# Altium schematic sheet Ethernet.SchDoc
size 420 x 297 mm; Address1: Address1; Address2: Address2; Address3: Address3; Address4: Address4; DocumentNumber: *Э3; SheetNumber: 13; SheetTotal: 15; DocumentType: Схема электрическая *
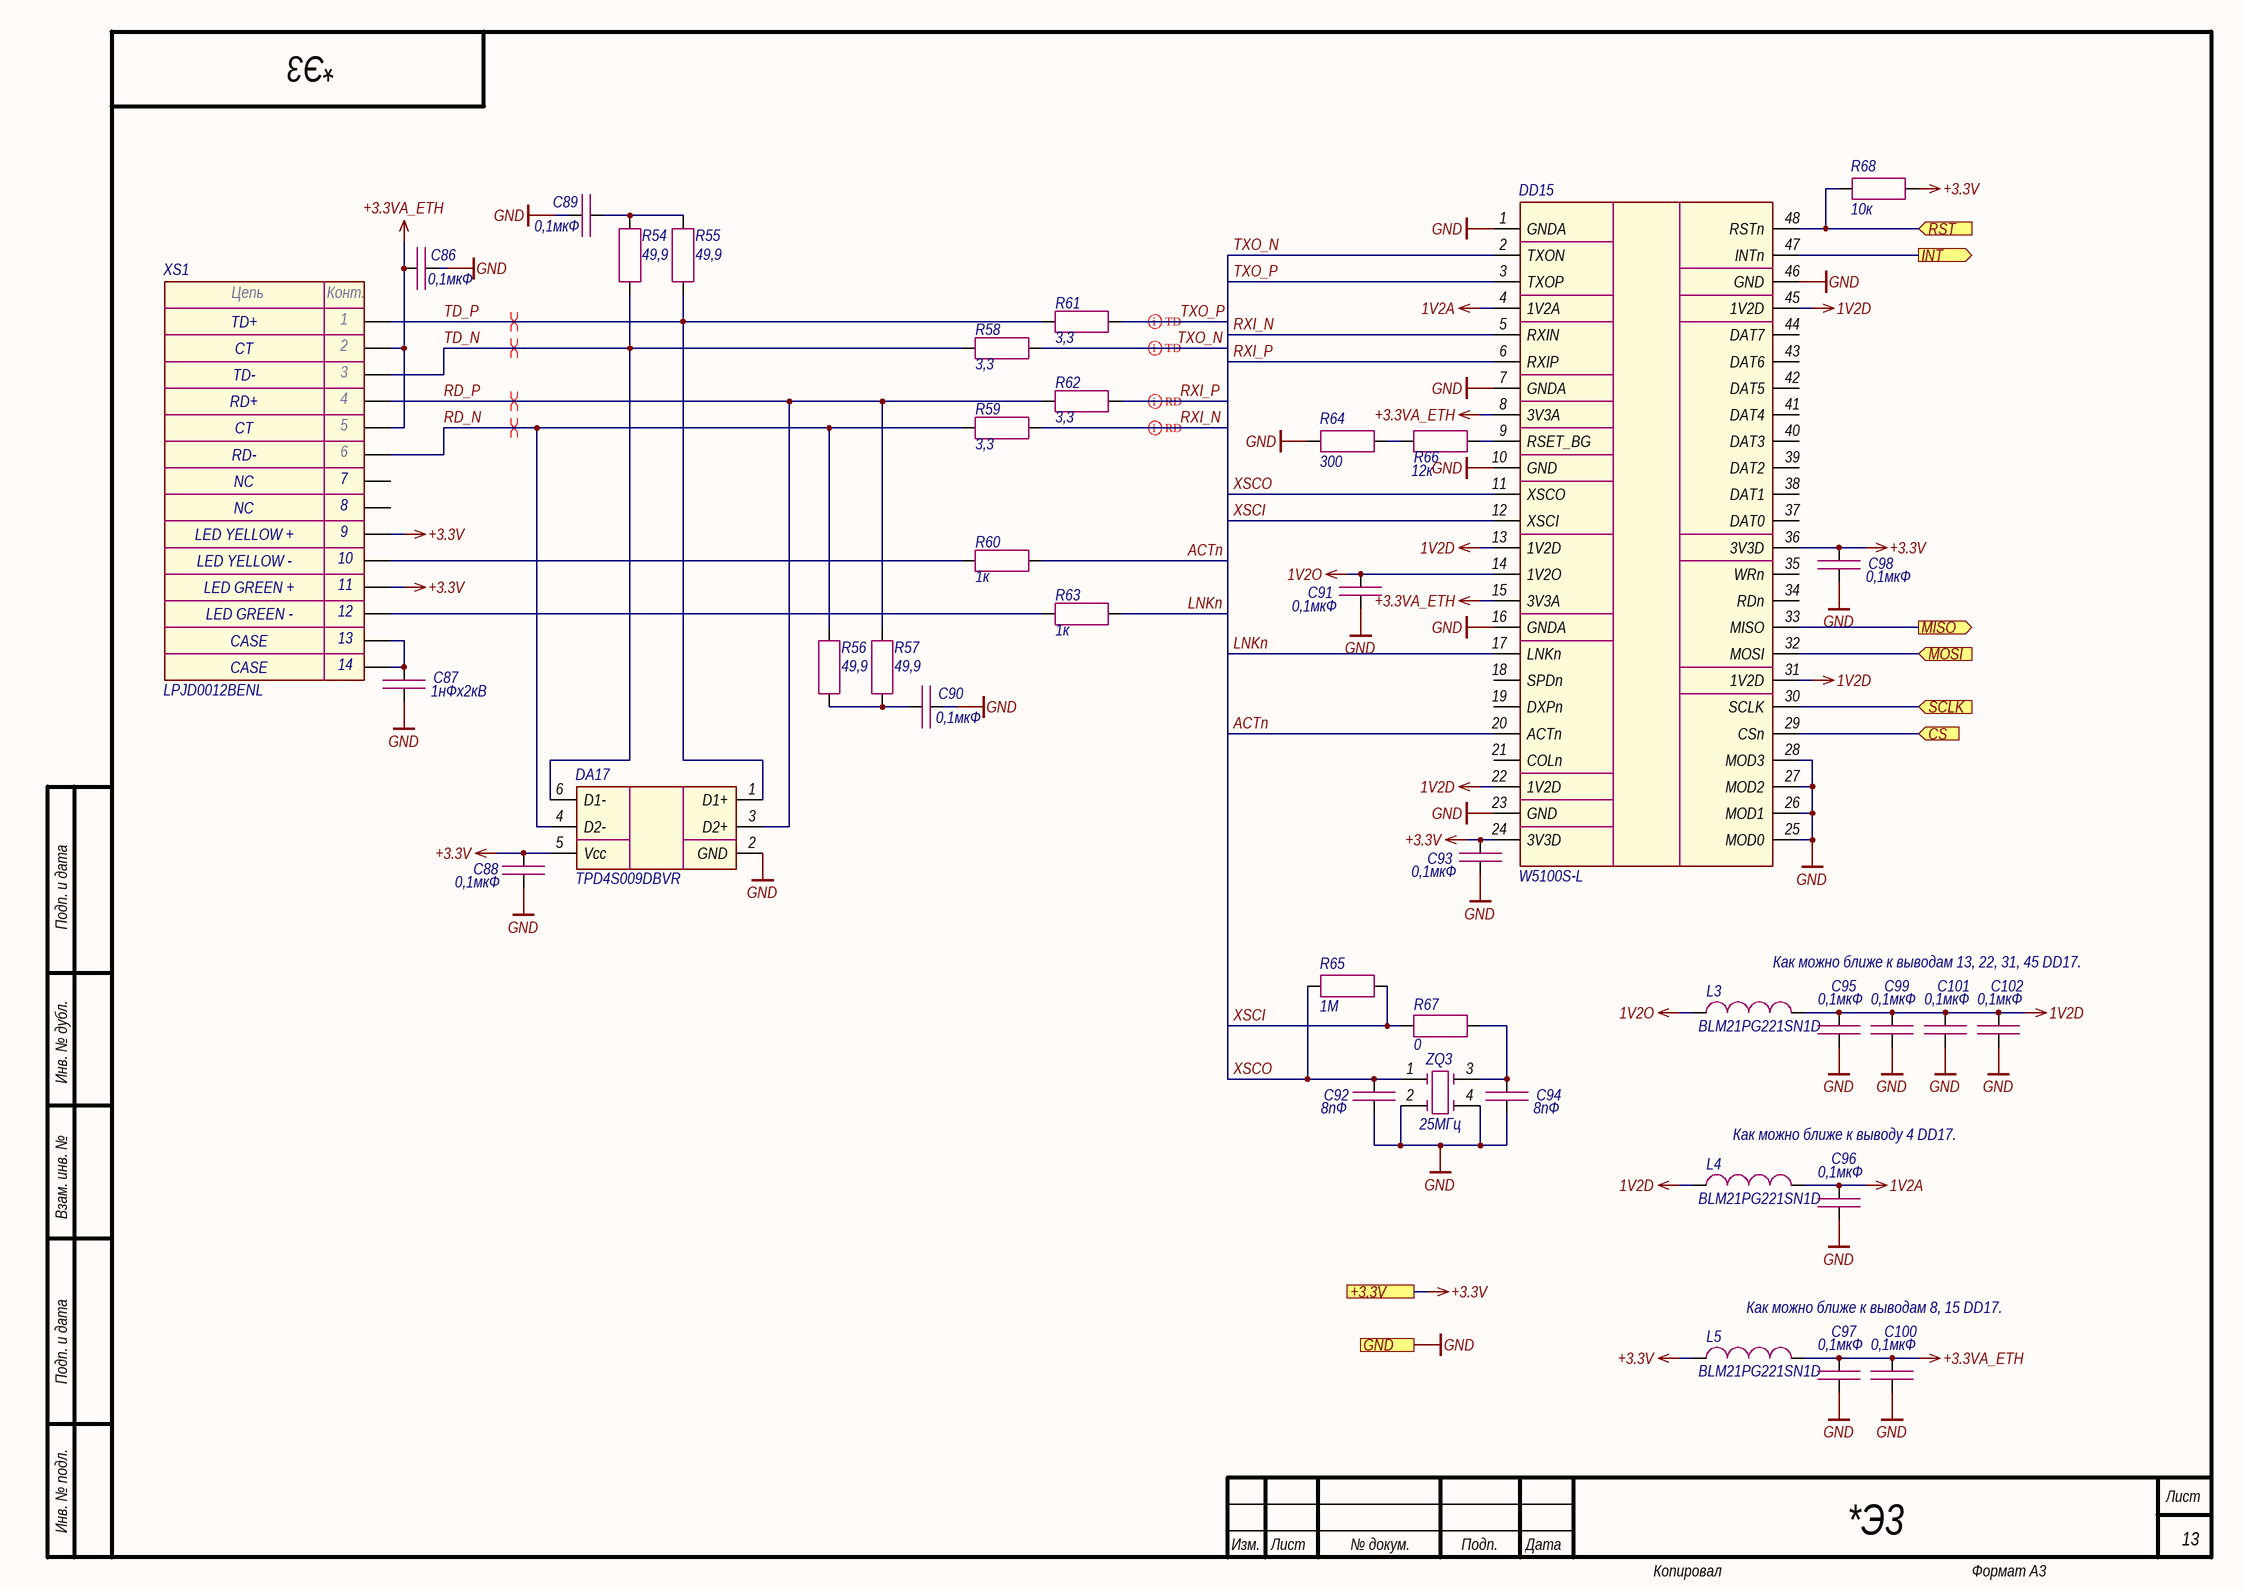
[diagram p0: Ethernet.SchDoc]

## Parts
C86  0,1мкФ  [CAP_0603]
C87  1нФх2кВ  [CAP_1206]
C88  0,1мкФ  [CAP_0603]
C89  0,1мкФ  [CAP_0603]
C90  0,1мкФ  [CAP_0603]
C91  0,1мкФ  [CAP_0603]
C92  8пФ  [CAP_0603]
C93  0,1мкФ  [CAP_0603]
C94  8пФ  [CAP_0603]
C95  0,1мкФ  [CAP_0603]
C96  0,1мкФ  [CAP_0603]
C97  0,1мкФ  [CAP_0603]
C98  0,1мкФ  [CAP_0603]
C99  0,1мкФ  [CAP_0603]
C100  0,1мкФ  [CAP_0603]
C101  0,1мкФ  [CAP_0603]
C102  0,1мкФ  [CAP_0603]
DA17  TPD4S009DBVR  [SOT-23-6]
DD15  W5100S-L  [LQFP-48]
L3  BLM21PG221SN1D  [IND_0805]
L4  BLM21PG221SN1D  [IND_0805]
L5  BLM21PG221SN1D  [IND_0805]
R54  49,9  [RES_0603]
R55  49,9  [RES_0603]
R56  49,9  [RES_0603]
R57  49,9  [RES_0603]
R58  3,3  [RES_0603]
R59  3,3  [RES_0603]
R60  1к  [RES_0603]
R61  3,3  [RES_0603]
R62  3,3  [RES_0603]
R63  1к  [RES_0603]
R64  300  [RES_0603]
R65  1М  [RES_0603]
R66  12к  [RES_0603]
R67  0  [RES_0603]
R68  10к  [RES_0603]
XS1  LPJD0012BENL  [LPJD0012BENL]
ZQ3  25МГц  [7M]

## Ports
+3.3V (see Main[1C], Button[1D], Fiber_interlock[2C], Flow_sensor[2C], Hardwiring[3D], LD_driver[1D], Power_supply[1D], Power_supply_CAN[1D], SF_driver[2C]), CS (in, see Main[1C]), GND (see Main[1C], Button[1D], Column[1C], Fiber_interlock[2C], Flow_sensor[2C], Guide_laser[1C], Hardwiring[3D], Indication[1C], LD_driver[1D], Power_supply[1D], Power_supply_CAN[1D], SF_driver[2D]), INT (out, see Main[1C]), MISO (out, see Main[1C]), MOSI (in, see Main[1C]), RST (in, see Main[1C]), SCLK (in, see Main[1C])

## Nets
1V2A: C96.1 DD15.4(1V2A) L4.2
1V2D: C95.1 C99.1 C101.1 C102.1 DD15.13(1V2D) DD15.22(1V2D) DD15.31(1V2D) DD15.45(1V2D) L3.2 L4.1
1V2O: C91.1 DD15.14(1V2O) L3.1
+3.3V: C88.1 C93.1 C98.1 DA17.5(Vcc) DD15.24(3V3D) DD15.36(3V3D) L5.1 R68.2 XS1.9 XS1.11 ; port +3.3V
+3.3VA_ETH: C86.1 C97.1 C100.1 DD15.8(3V3A) DD15.15(3V3A) L5.2 XS1.2 XS1.5
GND: C86.2 C87.2 C88.2 C89.2 C90.2 C91.2 C92.2 C93.2 C94.2 C95.2 C96.2 C97.2 C98.2 C99.2 C100.2 C101.2 C102.2 DA17.2(GND) DD15.1(GNDA) DD15.7(GNDA) DD15.10(GND) DD15.16(GNDA) DD15.23(GND) DD15.25(MOD0) DD15.26(MOD1) DD15.27(MOD2) DD15.28(MOD3) DD15.46(GND) R64.1 ZQ3.2 ZQ3.4 ; port GND
ACTn: DD15.20(ACTn) R60.2
CS: DD15.29(CSn) ; port CS
INT: DD15.47(INTn) ; port INT
LNKn: DD15.17(LNKn) R63.2
MISO: DD15.33(MISO) ; port MISO
MOSI: DD15.32(MOSI) ; port MOSI
RD_N: DA17.4(D2-) R56.1 R59.2 XS1.6
RD_P: DA17.3(D2+) R57.1 R62.2 XS1.4
RST: DD15.48(RSTn) R68.1 ; port RST
RXI_N: DD15.5(RXIN) R59.1
RXI_P: DD15.6(RXIP) R62.1
SCLK: DD15.30(SCLK) ; port SCLK
TD_N: DA17.6(D1-) R54.1 R58.2 XS1.3
TD_P: DA17.1(D1+) R55.1 R61.2 XS1.1
TXO_N: DD15.2(TXON) R58.1
TXO_P: DD15.3(TXOP) R61.1
XSCI: DD15.12(XSCI) R65.2 R67.1
XSCO: C92.1 DD15.11(XSCO) R65.1 ZQ3.1
NetC87_1: C87.1 XS1.13 XS1.14
NetC89_1: C89.1 R54.2 R55.2
NetC90_1: C90.1 R56.2 R57.2
NetC94_1: C94.1 R67.2 ZQ3.3
NetDD15_9: DD15.9(RSET_BG) R66.2
NetR60_1: R60.1 XS1.10
NetR63_1: R63.1 XS1.12
NetR64_2: R64.2 R66.1

Not connected (* = marked no-connect by the designer): DD15 18(SPDn) 19(DXPn) 21(COLn) 34(RDn) 35(WRn) 37(DAT0) 38(DAT1) 39(DAT2) 40(DAT3) 41(DAT4) 42(DAT5) 43(DAT6) 44(DAT7); XS1 7 8

## Layout directives
differential pair; differential pair class TD: TXO_N, TXO_P
differential pair; differential pair class RD: RXI_N, RXI_P
differential pair: RD_N, RD_P, TD_N, TD_P

## Notes on the sheet
- Как можно ближе к выводам 13, 22, 31, 45 DD17.
- Как можно ближе к выводу 4 DD17.
- Как можно ближе к выводам 8, 15 DD17.
- Подп. и дата
- Инв. № дубл.
- Взам. инв. №
- Инв. № подл.
- Изм.
- Лист
- № докум.
- Подп.
- Дата
- Копировал
- Формат А3
- (in symbol LPJD0012BENL) Цепь; Конт.; TD+; CT; TD-; RD+; RD-; NC; LED YELLOW +; LED YELLOW -; LED GREEN +; LED GREEN -; CASE

## Library data of the parts
C86 C88-C91 C93 C95-C102 = Capacitor: Manufacturer: Murata; Model: GRM188R71H104KA93D; Value: 0,1мкФ; Document: *
C87 = Capacitor: Manufacturer: Yageo; Model: CC1206KKX7RDBB102; Value: 1нФх2кВ; Document: *
C92 C94 = Capacitor: Manufacturer: Yageo; Model: CC0603CRNPO9BN8R0; Value: 8пФ; Document: *
DA17 = TPD4S009: Manufacturer: Texas Instruments; Model: TPD4S009DBVR; Document: *
DD15 = W5100S: Manufacturer: Wiznet; Model: W5100S-L; Document: *
L3-L5 = Inductor: Manufacturer: Murata; Value: *; Model: BLM21PG221SN1D; Document: *
R54-R57 = Resistor: Manufacturer: Yageo; Model: RC0603FR-0749R9L; Value: 49,9; Document: *
R58 R59 R61 R62 = Resistor: Manufacturer: Yageo; Model: RC0603FR-073R3L; Value: 3,3; Document: *
R60 R63 = Resistor: Manufacturer: Yageo; Model: RC0603FR-071KL; Value: 1к; Document: *
R64 = Resistor: Manufacturer: Yageo; Model: RC0603FR-07300RL; Value: 300; Document: *
R65 = Resistor: Manufacturer: Yageo; Model: RC0603FR-071ML; Value: 1М; Document: *
R66 = Resistor: Manufacturer: Yageo; Model: RC0603FR-0712KL; Value: 12к; Document: *
R67 = Resistor: Manufacturer: Yageo; Model: RC0603JR-070RL; Value: 0; Document: *
R68 = Resistor: Manufacturer: Yageo; Model: RC0603FR-0710KL; Value: 10к; Document: *
XS1 = LPJD0012BENL: Manufacturer: LINK-PP; Model: LPJD0012BENL; Document: *
ZQ3 = Quartz_Resonator_4-pin: Manufacturer: TXC; Model: 7M-25.000MAAJ-T; Value: 25МГц; Document: *